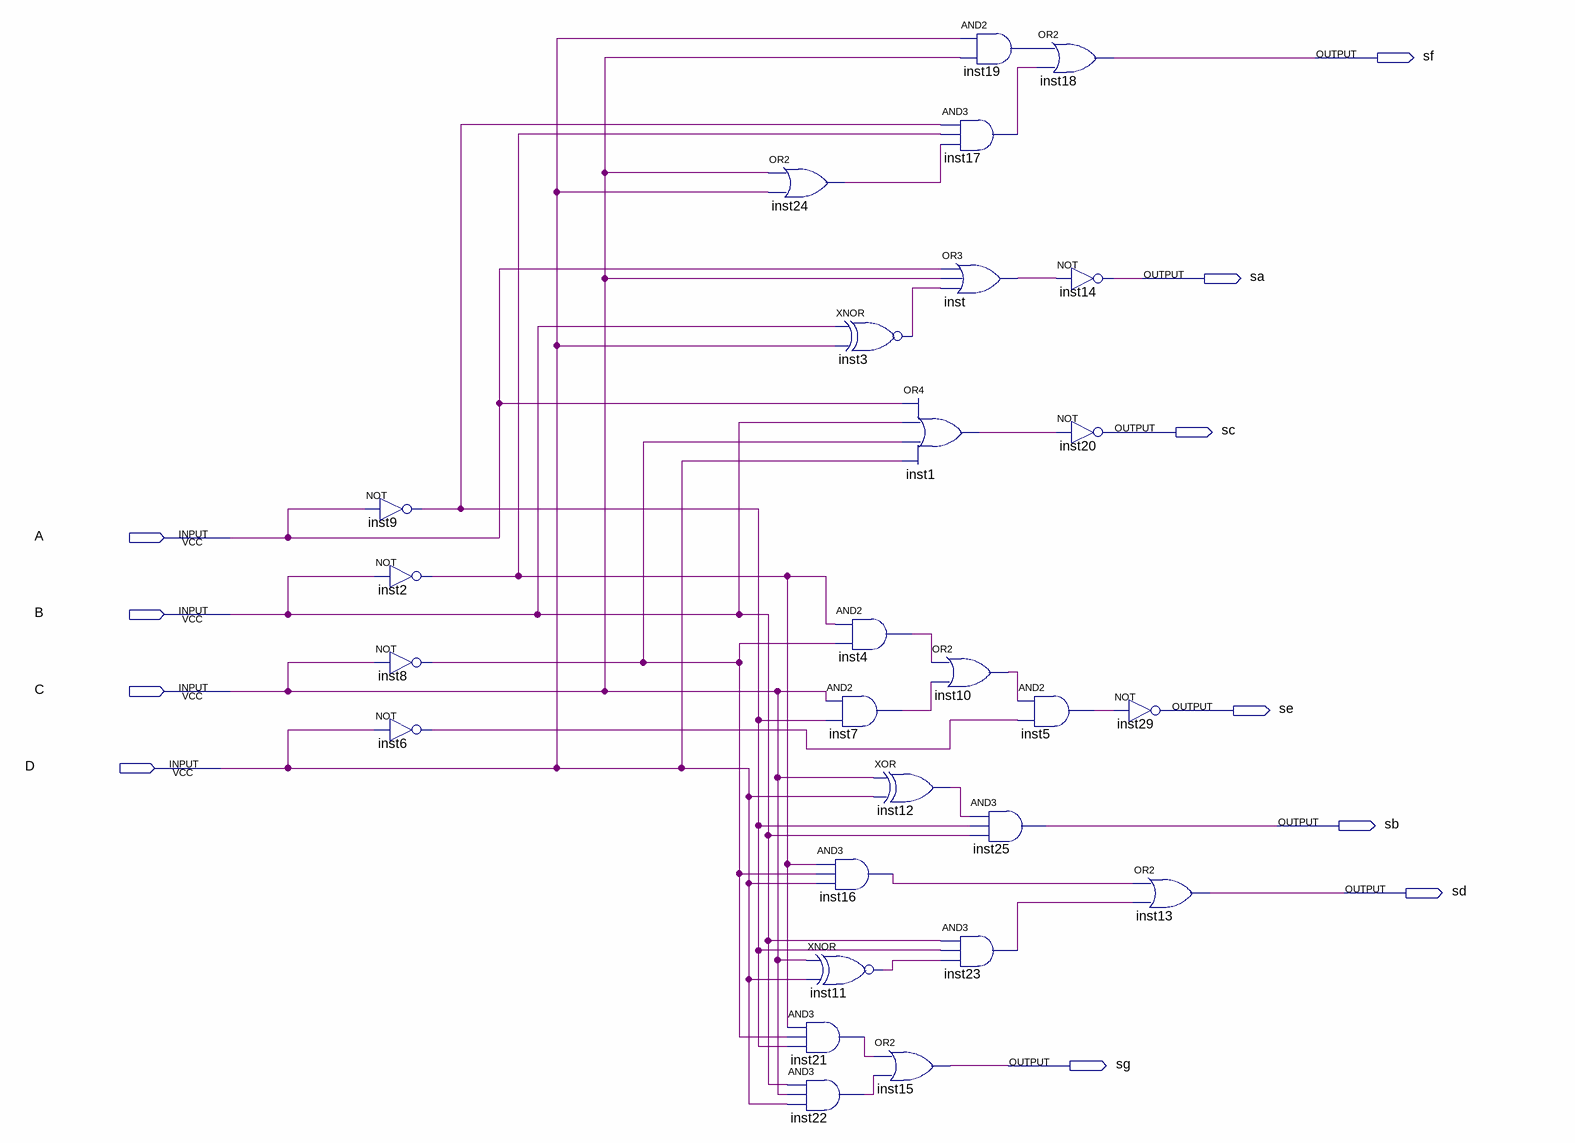
[diagram p0: schematic sheet]
// Quartus schematic Panel7seg.bdf as structural Verilog: 27 symbols, 11 pins
module Panel7seg (
  input  A,
  input  B,
  input  C,
  input  D,
  output sf,
  output sa,
  output sc,
  output se,
  output sb,
  output sd,
  output sg
);

  wire inst1_out, inst2_out, inst3_out, inst4_out, inst5_out, inst6_out, inst7_out, inst8_out, inst9_out,
       inst10_out, inst11_out, inst12_out, inst16_out, inst17_out, inst19_out, inst21_out, inst22_out,
       inst23_out, inst24_out, inst_out;

  not inst9 (inst9_out, A);
  not inst2 (inst2_out, B);
  not inst8 (inst8_out, C);
  not inst6 (inst6_out, D);
  or inst24 (inst24_out, C, D);
  xnor inst3 (inst3_out, B, D);
  and inst4 (inst4_out, inst2_out, inst8_out);
  and inst7 (inst7_out, C, inst9_out);
  and inst16 (inst16_out, inst2_out, inst8_out, D);
  xnor inst11 (inst11_out, C, D);
  and inst21 (inst21_out, inst2_out, inst8_out, inst9_out);
  and inst22 (inst22_out, B, C, D);
  or inst1 (inst1_out, A, B, inst8_out, D);
  or inst10 (inst10_out, inst4_out, inst7_out);
  xor inst12 (inst12_out, C, D);
  or inst15 (sg, inst21_out, inst22_out);
  and inst19 (inst19_out, D, C);
  and inst17 (inst17_out, inst9_out, inst2_out, inst24_out);
  or inst (inst_out, A, C, inst3_out);
  and inst25 (sb, inst12_out, inst9_out, B);
  and inst23 (inst23_out, B, inst9_out, inst11_out);
  or inst18 (sf, inst19_out, inst17_out);
  not inst14 (sa, inst_out);
  not inst20 (sc, inst1_out);
  and inst5 (inst5_out, inst10_out, inst6_out);
  not inst29 (se, inst5_out);
  or inst13 (sd, inst16_out, inst23_out);
endmodule
